# EAGLE schematic Shruti-Main-v04 (EAGLE 5.06)
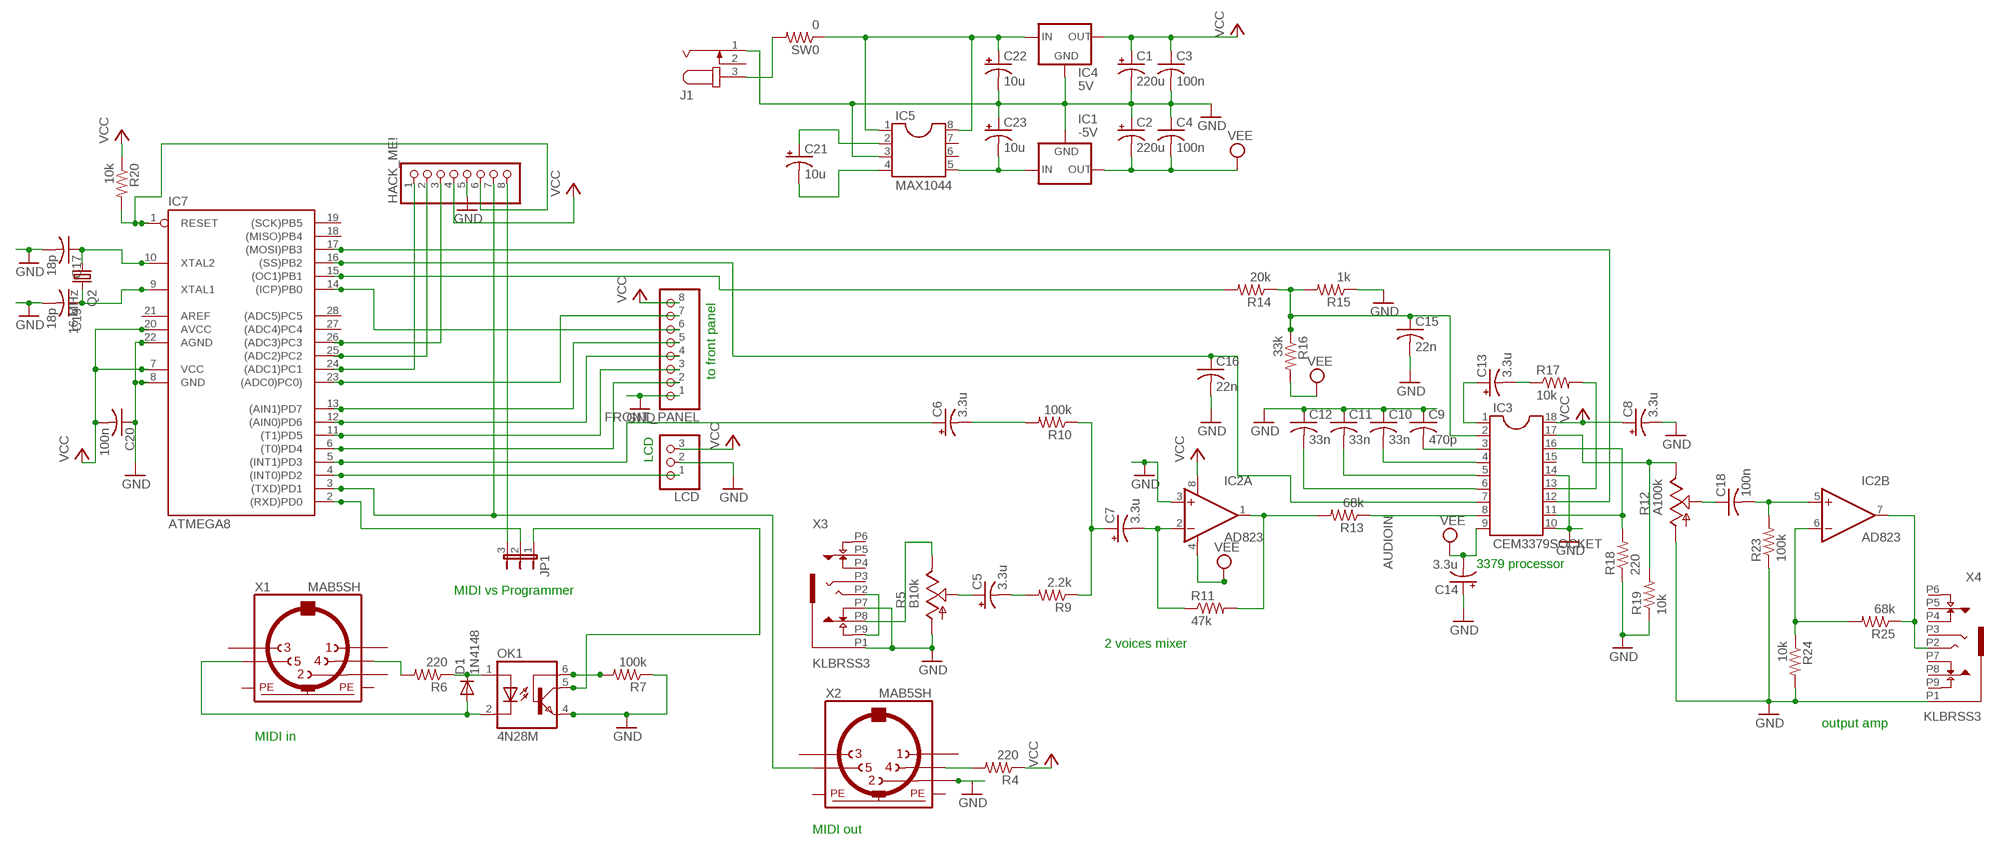
[diagram p0: schematic, sheet 1]

## Parts
C1  220u  CPOL-USE5-8.5  [E5-8,5]
C2  220u  CPOL-USE5-8.5  [E5-8,5]
C3  100n  C-US050-024X044  [C050-024X044]
C4  100n  C-US050-024X044  [C050-024X044]
C5  3.3u  CPOL-USE2.5-6  [E2,5-6]
C6  3.3u  CPOL-USE2.5-6  [E2,5-6]
C7  3.3u  CPOL-USE2.5-6  [E2,5-6]
C8  3.3u  CPOL-USE2.5-6  [E2,5-6]
C9  470p  C-US050-024X044  [C050-024X044]
C10  33n  C-US050-025X075  [C050-025X075]
C11  33n  C-US050-025X075  [C050-025X075]
C12  33n  C-US050-025X075  [C050-025X075]
C13  3.3u  CPOL-USE2.5-6  [E2,5-6]
C14  3.3u  CPOL-USE2.5-6  [E2,5-6]
C15  22n  C-US050-025X075  [C050-025X075]
C16  22n  C-US050-025X075  [C050-025X075]
C17  18p  C-US050-024X044  [C050-024X044]
C18  100n  C-US050-024X044  [C050-024X044]
C19  18p  C-US050-024X044  [C050-024X044]
C20  100n  C-US050-024X044  [C050-024X044]
C21  10u  CPOL-USE2.5-6  [E2,5-6]
C22  10u  CPOL-USE2.5-6  [E2,5-6]
C23  10u  CPOL-USE2.5-6  [E2,5-6]
D1  1N4148  1N4148DO35-7  [DO35-7]
FRONT_PANEL  PINHD-1X8  [1X08]
HACK_ME!  PINHD-1X8  [1X08]
IC1  -5V  79XXL  [79XXL]
IC2  AD823  OPA2132P  [DIL08]
IC3  CEM3379SOCKET  [SOCKET18]
IC4  5V  78XXL  [78XXL]
IC5  MAX1044  DIL8  [DIL08]
IC7  ATMEGA8  AT90S4433P  [DIL28-3]
J1  JACK-PLUG1  [SPC4078]
JP1  JP2E  [JP2]
LCD  PINHD-1X3  [1X03]
OK1  4N28M  [DIL06]
Q2  16 MHz  CRYSTALHC49U-V  [HC49U-V]
R4  220  R-US_0204/7  [0204/7]
R5  B10k  POT_USCABLED  [CABLE_POT_6MM]
R6  220  R-US_0204/7  [0204/7]
R7  100k  R-US_0204/7  [0204/7]
R9  2.2k  R-US_0204/7  [0204/7]
R10  100k  R-US_0204/7  [0204/7]
R11  47k  R-US_0204/7  [0204/7]
R12  A100k  POT_USCABLED  [CABLE_POT_6MM]
R13  68k  R-US_0204/7  [0204/7]
R14  20k  R-US_0204/7  [0204/7]
R15  1k  R-US_0204/7  [0204/7]
R16  33k  R-US_0204/7  [0204/7]
R17  10k  R-US_0204/7  [0204/7]
R18  220  R-US_0204/7  [0204/7]
R19  10k  R-US_0204/7  [0204/7]
R20  10k  R-US_0204/7  [0204/7]
R23  100k  R-US_0204/7  [0204/7]
R24  10k  R-US_0204/7  [0204/7]
R25  68k  R-US_0204/7  [0204/7]
SW0  0  R-US_0204/2V  [0204V]
X1  MAB5SH  [MAB5SH]
X2  MAB5SH  [MAB5SH]
X3  KLBRSS3  [KLBRSS3]
X4  KLBRSS3  [KLBRSS3]

## Nets
AUDIOIN: IC2.1(A:OUT) R11.2 R13.2
GND: C1.- C2.+ C3.2 C4.1 C8.- C9.1 C10.1 C11.1 C12.1 C14.+ C15.2 C16.2 C17.2 C19.2 C20.1 C22.- C23.+ FRONT_PANEL.1 HACK_ME!.5 IC1.GND IC2.3(A:+IN) IC3.10(GND) IC3.14(PANCV) IC4.GND IC5.3 IC7.8(GND) IC7.22(AGND) J1.1 LCD.2 OK1.4(EMI) R5.A R7.1 R12.A R15.1 R18.1 R19.1 R23.1 R24.2 X2.2 X3.P1 X3.P7 X4.P1
N$1: HACK_ME!.8 JP1.3
N$2: C22.+ IC4.IN IC5.1 IC5.8 SW0.1
N$3: C21.+ IC5.2
N$4: FRONT_PANEL.2 IC7.6((T0)PD4)
N$5: IC3.8(VCFIN) R13.1
N$6: R4.2 X2.4
N$7: HACK_ME!.2 IC7.25((ADC2)PC2)
N$8: FRONT_PANEL.7 IC7.23((ADC0)PC0))
N$9: FRONT_PANEL.4 IC7.12((AIN0)PD6)
N$10: FRONT_PANEL.5 IC7.13((AIN1)PD7)
N$11: IC7.4((INT0)PD2) LCD.1
N$12: C6.- R10.2
N$13: HACK_ME!.7 IC7.3((TXD)PD1) X2.5
N$14: D1.C OK1.1(A) R6.1
N$15: C17.1 IC7.10(XTAL2) Q2.1
N$16: D1.A OK1.2(C) X1.5
N$17: R6.2 X1.4
N$18: JP1.1 OK1.5(COL)
N$19: C5.+ R5.S
N$20: C6.+ IC7.5((INT1)PD3)
N$21: C7.- IC2.2(A:-IN) R11.1
N$22: FRONT_PANEL.3 IC7.11((T1)PD5)
N$23: C7.+ R9.1 R10.1
N$24: C5.- R9.2
N$25: C18.2 IC2.5(B:+IN) R23.2
N$26: C9.2 IC3.3(CD)
N$27: C10.2 IC3.4(CC)
N$29: C11.2 IC3.5(CB)
N$30: IC3.17(CHB) R12.E R19.2
N$31: C12.2 IC3.6(CA)
N$32: IC7.15((OC1)PB1) R14.2
N$33: C16.1 IC3.7(RESONANCECV) IC7.16((SS)PB2)
N$34: IC3.12(GAINCV) IC7.17((MOSI)PB3)
N$35: IC3.13(VCAIN) R17.2
N$36: C13.- R17.1
N$37: IC2.7(B:OUT) R25.1 X4.P2
N$38: IC3.11(VCAOUT) IC3.16(PANIN) R18.2
N$39: C13.+ IC3.1(VCFOUT)
N$41: R5.E X3.P8
N$42: HACK_ME!.6 IC7.1(RESET) R20.2
N$43: C15.1 IC3.2(FREQUENCYCV) R14.1 R15.2 R16.1
N$44: C18.1 R12.S
N$45: IC2.6(B:-IN) R24.1 R25.2
N$47: J1.3 SW0.2
N$48: C19.1 IC7.9(XTAL1) Q2.2
N$49: HACK_ME!.3 IC7.26((ADC3)PC3)
N$50: FRONT_PANEL.6 IC7.14((ICP)PB0)
N$51: OK1.6(BAS) R7.2
N$52: HACK_ME!.1 IC7.24((ADC1)PC1)
N$53: IC7.2((RXD)PD0) JP1.2
N$55: C21.- IC5.4
N$56: C23.- IC1.IN IC5.5
N$57: X3.P2 X3.P9
VCC: C1.+ C3.1 C8.+ C20.2 FRONT_PANEL.8 HACK_ME!.4 IC2.8(A:V+) IC3.18(VCC) IC4.OUT IC7.7(VCC) IC7.20(AVCC) LCD.3 R4.1 R20.1
VEE: C2.- C4.2 C14.- IC1.OUT IC2.4(A:V-) IC3.9(VEE) R16.2
Unconnected: IC3.15(CHAOUT) IC5.6 IC5.7 IC7.18((MISO)PB4) IC7.19((SCK)PB5) IC7.21(AREF) IC7.27((ADC4)PC4) IC7.28((ADC5)PC5) J1.2 X1.1 X1.2 X1.3 X2.1 X2.3 X3.P3 X3.P4 X3.P5 X3.P6 X4.P3 X4.P4 X4.P5 X4.P6 X4.P7 X4.P8 X4.P9

## Notes on the sheet
- to front panel
- LCD
- 3379 processor
- MIDI vs Programmer
- 2 voices mixer
- output amp
- MIDI in
- MIDI out

## Power pins joined to a net without a drawn wire
PE: X1.PE X1.PE@(PE) X2.PE X2.PE@(PE)

## Library data of the parts
C1 C2 C5-C8 C13 C14 C21-C23 = rcl:CPOL-US: POLARIZED CAPACITOR, American symbol
C3 C4 C9-C12 C15-C20 = rcl:C-US: CAPACITOR, American symbol
D1 = diode:1N4148: DIODE high speed (Philips)
FRONT_PANEL HACK_ME! = pinhead:PINHD-1X8: PIN HEADER
IC1 = v-reg:79XXL: VOLTAGE REGULATOR
IC2 = burr-brown:OPA2132: High Speed FET-Input Operational Amplifiers< Product Folder:OPA2132
IC3 = cem:CEM3379: Voltage Controlled Signal Processor VCF+VCA+panner
IC4 = v-reg:78XXL: VOLTAGE REGULATOR
IC5 = ic-package:DIL8: Dual In Line / Socket
IC7 = atmel:AT90S4433: MICROCONTROLLER 4 Kbytes FLASH 128 bytes SRAM 256 bytes EEPROM UART 6-channel 10 bit ADC
J1 = con-jack:JACK-PLUG: DC POWER JACK Power Jack, DC, Right Angle, Through Hole, Rated 5A at 16VDC, PC Terminals Distributor: Farnell (www.Farnell.de) Drawing: 84N1161.pdf / 84N1162.pdf Manufacturer: SPC Technology (www.spctechnology.com) Type: SPC4077 / SPC 4078
JP1 = jumper:JP2E: JUMPER
LCD = pinhead:PINHD-1X3: PIN HEADER
OK1 = optocoupler:4N*?M: General Purpose 6-Pin Phototransistor Optocouplers Source: http://www.fairchildsemi.com/ds/4N/4N35-M.pdf
Q2 = crystal:CRYSTAL: CRYSTAL
R4 R6 R7 R9-R11 R13-R20 R23-R25 SW0 = resistor:R-US_: RESISTOR, American symbol
R5 R12 = pot-cable:POT_US
X1 X2 = con-hirschmann:MAB5SH: Female CONNECTOR 5 pins 90 deg. with shield, horizontal (DIN 41524)
X3 X4 = klbrss3:KLBRSS3: 6.35" Jack connector